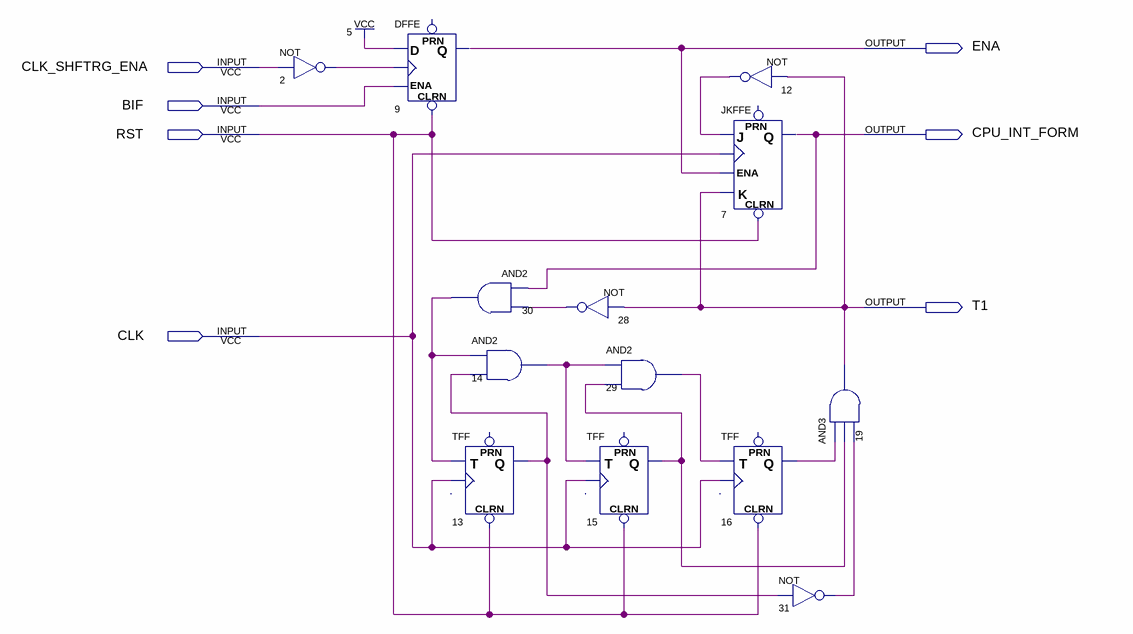
[diagram p0: schematic sheet]
// Quartus schematic cpu_int_form.bdf as structural Verilog: 13 symbols, 7 pins
module cpu_int_form (
  input  CLK_SHFTRG_ENA,
  input  BIF,
  input  RST,
  input  CLK,
  output ENA,
  output CPU_INT_FORM,
  output T1
);

  wire n2_out, n12_out, n13_q, n14_out, n15_q, n16_q, n28_out, n29_out, n30_out, n31_out;

  not u_2 (n2_out, CLK_SHFTRG_ENA);
  DFFE u_9 (.CLRN(RST), .D(1'b1), .CLK(n2_out), .ENA(BIF), .Q(ENA));  // open: PRN
  and u_30 (n30_out, CPU_INT_FORM, n28_out);
  and u_14 (n14_out, n30_out, n13_q);
  TFF u_13 (.CLRN(RST), .T(n30_out), .CLK(CLK), .Q(n13_q));  // open: PRN
  not u_28 (n28_out, T1);
  TFF u_15 (.CLRN(RST), .T(n14_out), .CLK(CLK), .Q(n15_q));  // open: PRN
  and u_29 (n29_out, n14_out, n15_q);
  not u_12 (n12_out, T1);
  JKFFE u_7 (.J(n12_out), .CLK(CLK), .CLRN(RST), .K(T1), .ENA(ENA), .Q(CPU_INT_FORM));  // open: PRN
  TFF u_16 (.CLRN(RST), .T(n29_out), .CLK(CLK), .Q(n16_q));  // open: PRN
  and u_19 (T1, n16_q, n15_q, n31_out);
  not u_31 (n31_out, n13_q);
endmodule
